# Altium schematic sheet Temp_Prephirals_Sheet.SchDoc
size A; SheetNumber: 4; SheetTotal: 4
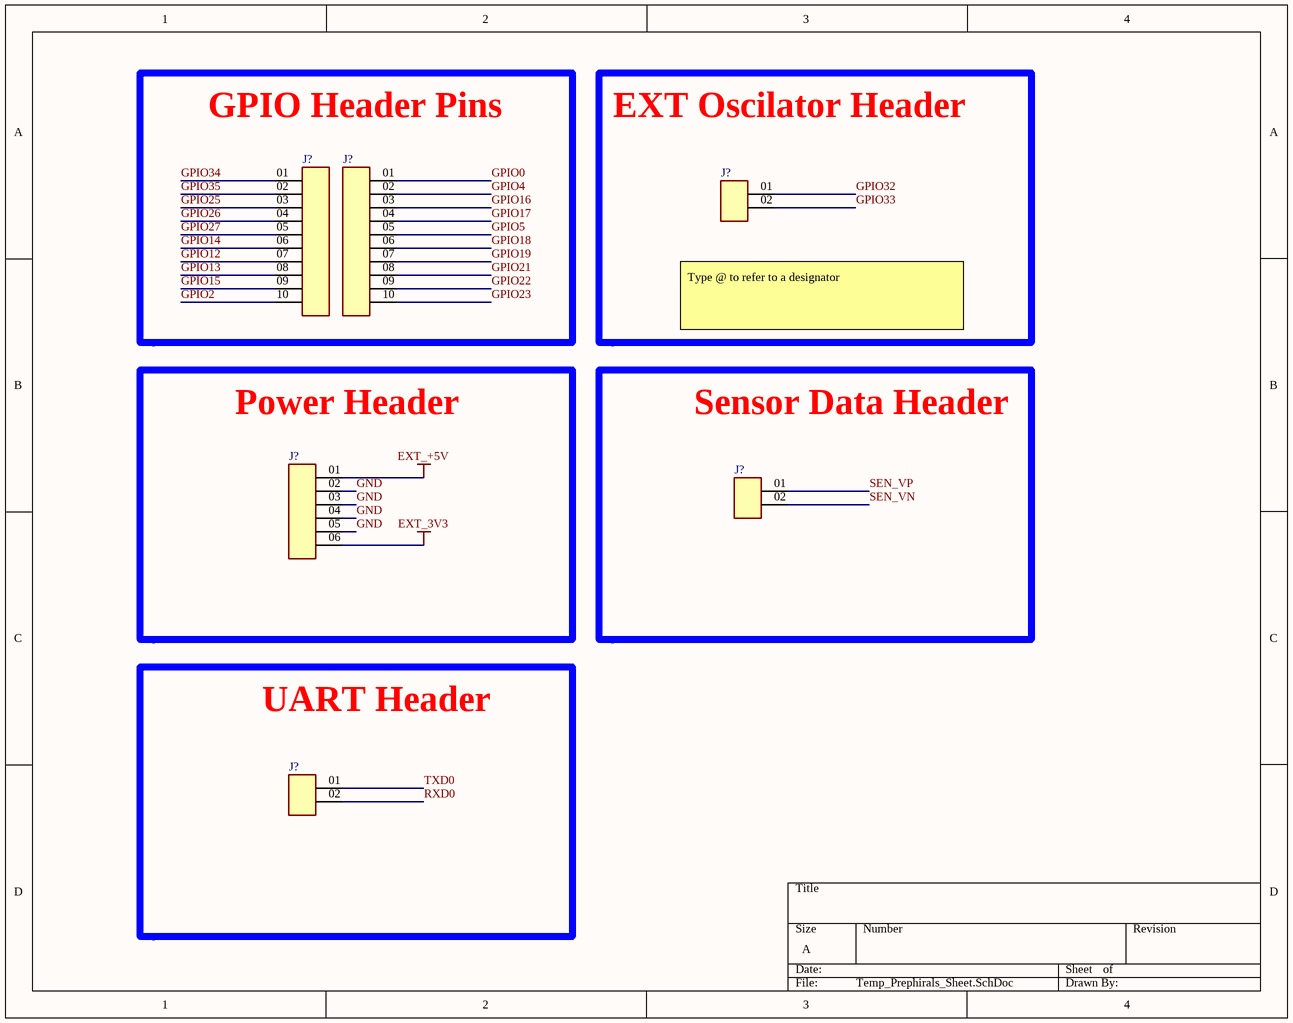
[diagram p0: Temp_Prephirals_Sheet.SchDoc]

## Parts
(Parts that share a designator on the sheet are numbered #1, #2 ... from top to bottom, then left to right.)
J?#1  Pin Headers 1x2  [Header Pin 1x2]  (value not drawn)
J?#2  Pin Header 1x10  [Pin Header 1x10]  (value not drawn)
J?#3  Pin Header 1x10  [Pin Header 1x10]  (value not drawn)
J?#4  Pin Headers 1x2  [Header Pin 1x2]  (value not drawn)
J?#5  Pin Headers 1x6  [Header Pin 1x6]  (value not drawn)
J?#6  Pin Headers 1x2  [Header Pin 1x2]  (value not drawn)

## Blocks framed on the sheet
GPIO Header Pins: J?#2 J?#3
EXT Oscilator Header: J?#1
Power Header: J?#5
Sensor Data Header: J?#4
UART Header: J?#6

## Nets
EXT_3V3: J?#5.06
EXT_+5V: J?#5.01
GND: J?#5.02 J?#5.03 J?#5.04 J?#5.05
GPIO0: J?#3.01
GPIO2: J?#2.10
GPIO4: J?#3.02
GPIO5: J?#3.05
GPIO12: J?#2.07
GPIO13: J?#2.08
GPIO14: J?#2.06
GPIO15: J?#2.09
GPIO16: J?#3.03
GPIO17: J?#3.04
GPIO18: J?#3.06
GPIO19: J?#3.07
GPIO21: J?#3.08
GPIO22: J?#3.09
GPIO23: J?#3.10
GPIO25: J?#2.03
GPIO26: J?#2.04
GPIO27: J?#2.05
GPIO32: J?#1.01
GPIO33: J?#1.02
GPIO34: J?#2.01
GPIO35: J?#2.02
RXD0: J?#6.02
SEN_VN: J?#4.02
SEN_VP: J?#4.01
TXD0: J?#6.01

## Notes on the sheet
- Type @ to refer to a designator

## Library data of the parts
J?#1 J?#4 J?#6 = Pin Headers 1x2: Pin Header male (2.54mm) 1X40 Straight Long (20 CM); ComponentLink1Description: Market Link; ComponentLink1URL: \https://free-electronic.com/product/pin-header-male-2-54mm-1x40-straight-long/
J?#2 J?#3 = Pin Header 1x10: Pin Header male (2.54mm) 1X40 Straight Long (20 CM)
J?#5 = Pin Headers 1x6: Pin Header male (2.54mm) 1X40 Straight Long (20 CM); ComponentLink1Description: Market Link; ComponentLink1URL: https://free-electronic.com/product/pin-header-male-2-54mm-1x40-straight-long/